# EAGLE design RS485Interface (EAGLE 7.2.0)
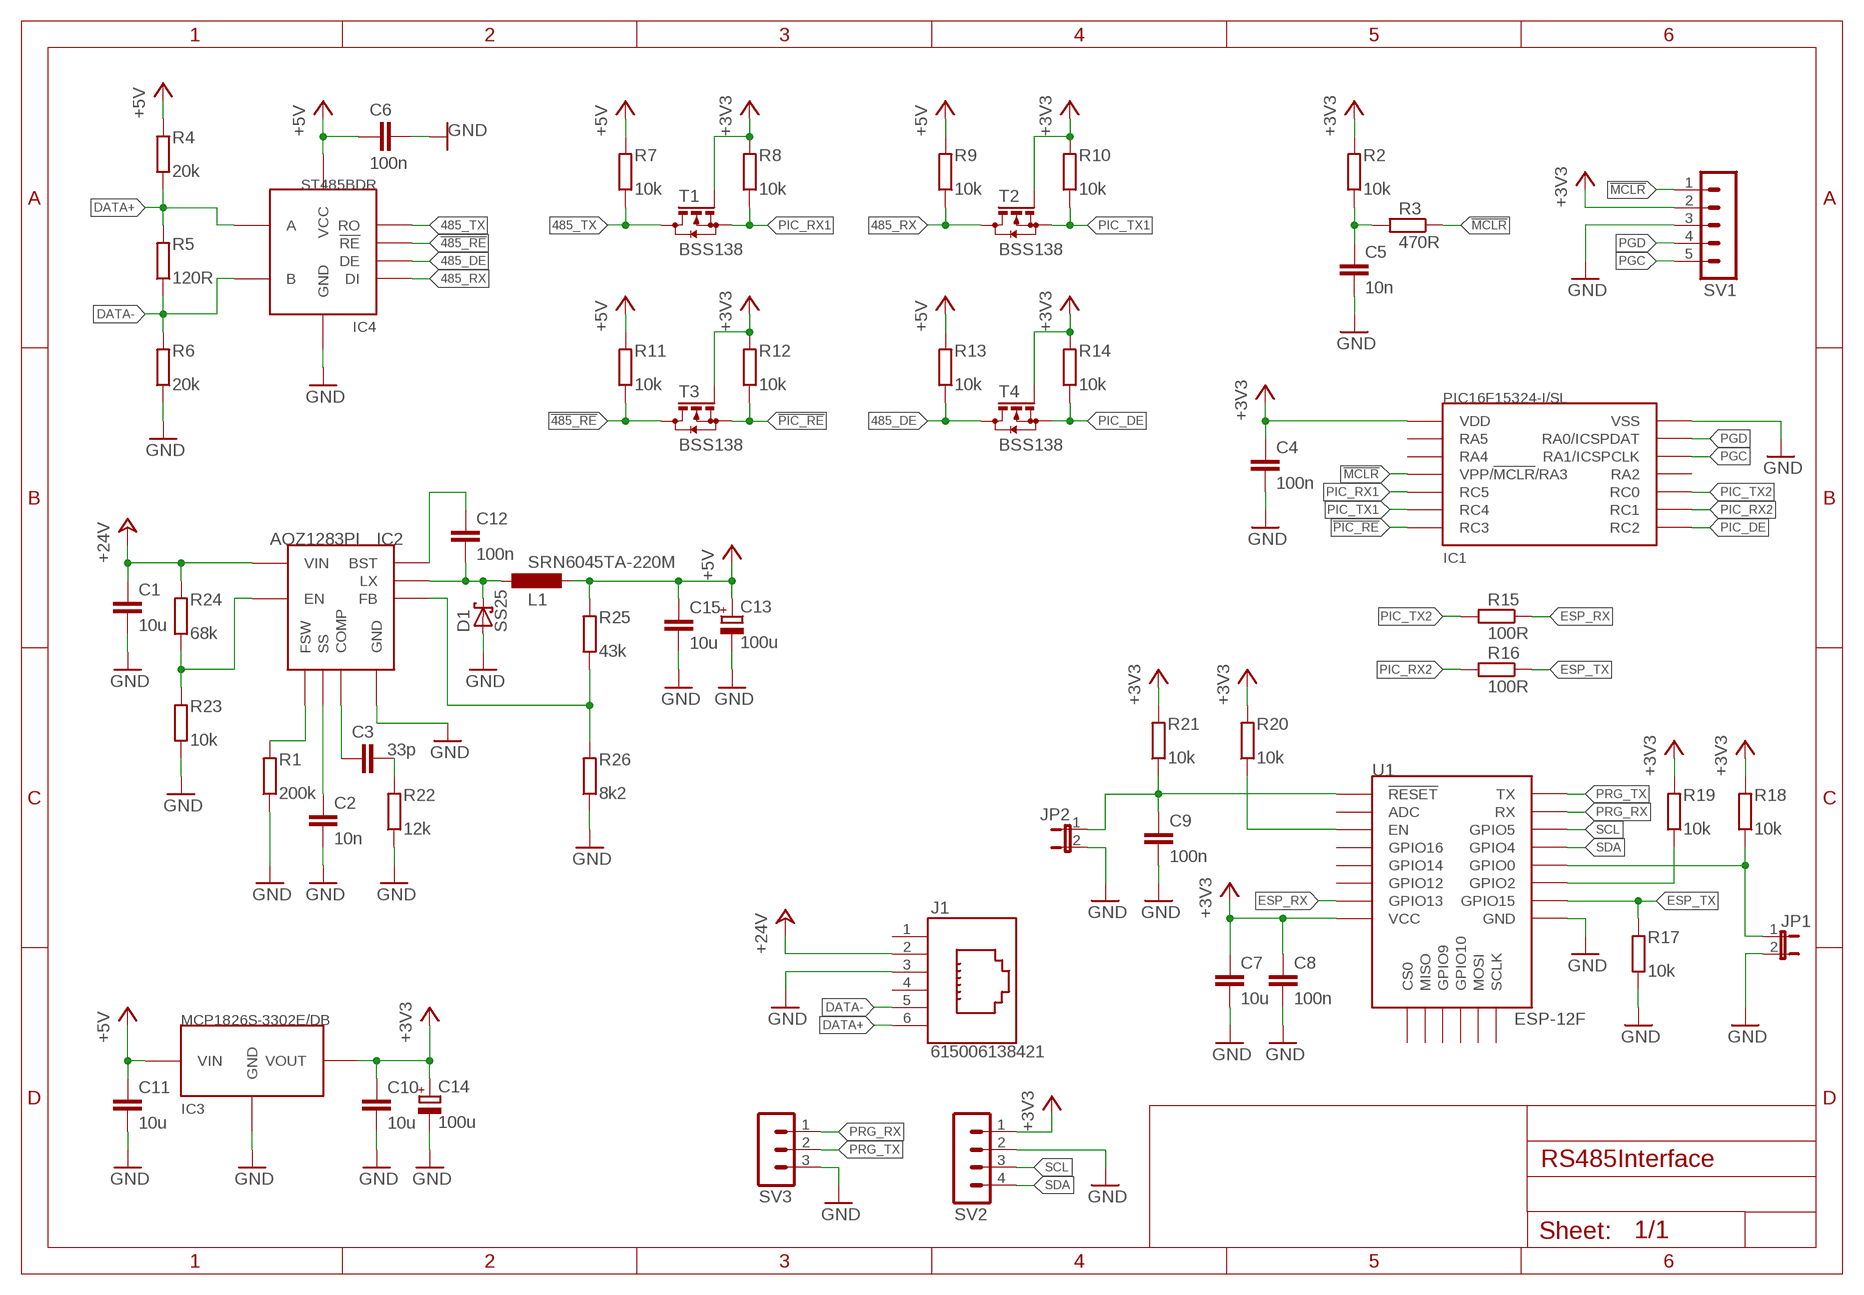
[diagram p0: schematic, sheet 1]

## Parts
C1  10u  C-EUC0805  [C0805]
C2  10n  C-EUC0805  [C0805]
C3  33p  C-EUC0805  [C0805]
C4  100n  C-EUC0805  [C0805]
C5  10n  C-EUC0805  [C0805]
C6  100n  C-EUC0805  [C0805]
C7  10u  C-EUC0805  [C0805]
C8  100n  C-EUC0805  [C0805]
C9  100n  C-EUC0805  [C0805]
C10  10u  C-EUC0805  [C0805]
C11  10u  C-EUC0805  [C0805]
C12  100n  C-EUC0805  [C0805]
C13  100u  UCL  [UCL6.3]
C14  100u  UCL  [UCL6.3]
C15  10u  C-EUC0805  [C0805]
D1  SS25  [DO-214AA]
IC1  PIC16F15324-I/SL  [SOIC14]
IC2  AOZ1283PI  [SO8+PAD]
IC3  MCP1826S-3302E/DB  [SOT-223-3]
IC4  ST485BDR  [SOIC8]
J1  615006138421  [615006138421]
JP1  JP1E  [JP1]
JP2  JP1E  [JP1]
L1  SRN6045TA-220M  [SRN6045TA]
R1  200k  R-EU_R0805  [R0805]
R2  10k  R-EU_R0805  [R0805]
R3  470R  R-EU_R0805  [R0805]
R4  20k  R-EU_R0805  [R0805]
R5  120R  R-EU_R0805  [R0805]
R6  20k  R-EU_R0805  [R0805]
R7  10k  R-EU_R0805  [R0805]
R8  10k  R-EU_R0805  [R0805]
R9  10k  R-EU_R0805  [R0805]
R10  10k  R-EU_R0805  [R0805]
R11  10k  R-EU_R0805  [R0805]
R12  10k  R-EU_R0805  [R0805]
R13  10k  R-EU_R0805  [R0805]
R14  10k  R-EU_R0805  [R0805]
R15  100R  R-EU_R0805  [R0805]
R16  100R  R-EU_R0805  [R0805]
R17  10k  R-EU_R0805  [R0805]
R18  10k  R-EU_R0805  [R0805]
R19  10k  R-EU_R0805  [R0805]
R20  10k  R-EU_R0805  [R0805]
R21  10k  R-EU_R0805  [R0805]
R22  12k  R-EU_R0805  [R0805]
R23  10k  R-EU_R0805  [R0805]
R24  68k  R-EU_R0805  [R0805]
R25  43k  R-EU_R0805  [R0805]
R26  8k2  R-EU_R0805  [R0805]
SV1  MA05-1  [MA05-1]
SV2  MA04-1  [MA04-1]
SV3  MA03-1  [MA03-1]
T1  BSS138  [SOT-23]
T2  BSS138  [SOT-23]
T3  BSS138  [SOT-23]
T4  BSS138  [SOT-23]
U1  ESP-12F  ESP12ESMD  [ESP12E-SMD]

## Nets
485_DE: IC4.P3(DE) R13.1 T4.P3(D)
485_RX: IC4.P4(DI) R9.1 T2.P3(D)
485_TX: IC4.P1(RO) R7.1 T1.P3(D)
!485_RE: IC4.P2(!RE) R11.1 T3.P3(D)
!MCLR: IC1.P4(VPP/!MCLR!/RA3) R3.1 SV1.1
!PIC_RE: IC1.P7(RC3) R12.1 T3.P2(S)
!RESET: C9.1 JP2.1 R21.1 U1.RESET(!RESET)
+3V3: C4.1 C7.1 C8.1 C10.1 C14.+ IC1.P1(VDD) IC3.P3(VOUT) R2.2 R8.2 R10.2 R12.2 R14.2 R18.2 R19.2 R20.2 R21.2 SV1.2 SV2.1 T1.P1(G) T2.P1(G) T3.P1(G) T4.P1(G) U1.VCC
+5V: C6.1 C11.1 C13.+ C15.1 IC3.P1(VIN) IC4.P8(VCC) L1.P$1 R4.2 R7.2 R9.2 R11.2 R13.2 R25.2
+24V: C1.1 IC2.PAD(VIN) J1.2 R24.2
DATA+: IC4.P6(A) J1.6 R4.1 R5.2
DATA-: IC4.P7(B) J1.5 R5.1 R6.2
EN: R20.1 U1.EN
ESP_RX: R15.1 U1.GPIO13
ESP_TX: R16.1 R17.2 U1.GPIO15
GND: C1.2 C2.2 C4.2 C5.2 C6.2 C7.2 C8.2 C9.2 C10.2 C11.2 C13.- C14.- C15.2 D1.A IC1.P14(VSS) IC2.P3(GND) IC3.P2(GND) IC3.P4(GND) IC4.P5(GND) J1.3 JP1.2 JP2.2 R1.1 R6.1 R17.1 R22.1 R23.1 R26.1 SV1.3 SV2.2 SV3.3 U1.GND
GPIO0: JP1.1 R18.1 U1.GPIO0
GPIO2: R19.1 U1.GPIO2
LX: C12.2 D1.C IC2.P1(LX) L1.P$2
N$1: IC2.P8(EN) R23.2 R24.1
N$2: C3.1 IC2.P5(COMP)
N$3: C5.1 R2.1 R3.2
N$4: C3.2 R22.2
N$5: C2.1 IC2.P7(SS)
N$6: IC2.P4(FSW) R1.2
N$7: IC2.P6(FB) R25.1 R26.2
N$9: C12.1 IC2.P2(BST)
PGC: IC1.P12(RA1/ICSPCLK) SV1.5
PGD: IC1.P13(RA0/ICSPDAT) SV1.4
PIC_DE: IC1.P8(RC2) R14.1 T4.P2(S)
PIC_RX1: IC1.P5(RC5) R8.1 T1.P2(S)
PIC_RX2: IC1.P9(RC1) R16.2
PIC_TX1: IC1.P6(RC4) R10.1 T2.P2(S)
PIC_TX2: IC1.P10(RC0) R15.2
PRG_RX: SV3.1 U1.RXD0(RX)
PRG_TX: SV3.2 U1.TXD0(TX)
SCL: SV2.3 U1.GPIO5
SDA: SV2.4 U1.GPIO4
Unconnected: IC1.P2(RA5) IC1.P3(RA4) IC1.P11(RA2) J1.1 J1.4 U1.ADC U1.CS0 U1.GPIO9 U1.GPIO10 U1.GPIO12 U1.GPIO14 U1.GPIO16 U1.MISO U1.MOSI U1.SCLK

## Library data of the parts
C1-C12 C15 = rcl:C-EU: CAPACITOR, European symbol
C13 C14 = RS485Interface:UCL*: UCL - ALUMINUM ELECTROLYTIC CAPACITORS Chip Type, Low Impedance; NR: UCL1C101MCL6GS
D1 = RS485Interface:SS2*: SS22 - S210 - Schottky Rectifier
IC1 = RS485Interface:PIC16F15324: PIC16F15324
IC2 = RS485Interface:AOZ1283PI: AOZ1283 EZBuck™ 2.5A Simple Buck Regulator
IC3 = RS485Interface:MCP1826S: MCP1826
IC4 = RS485Interface:ST485B: ST485B
J1 = InputOutputIO (rev19b):615006138421: WR-MJ Horizontal Plastic 6P6C Modular Jack Tab Up, 6 Pins=>Code : Con_I-O_MJ-H_Plastic_Up_615006138421 <http://katalog.we-online.de/media/images/eican/Con_I-O_MJ-H_Plastic_Up_6150xx138421_pf2.jpg> Details see: http://katalog.we-online.de/en/em/MJ_HORIZONTAL_PLASTIC_6PXC_TAB_UP Created 2014-07-10, Karrer Zheng 2014 (C) Würth Elektronik
JP1 JP2 = jumper:JP1E: JUMPER
L1 = RS485Interface:SRN6045TA-: SRN6045TA Series - Semi-shielded Power Inductors
R1-R26 = rcl:R-EU_: RESISTOR, European symbol
SV1 = con-lstb:MA05-1: PIN HEADER; OC_FARNELL: unknown; OC_NEWARK: unknown
SV2 = con-lstb:MA04-1: PIN HEADER; OC_FARNELL: unknown; OC_NEWARK: unknown
SV3 = con-lstb:MA03-1: PIN HEADER; OC_FARNELL: unknown; OC_NEWARK: unknown
T1-T4 = RS485Interface:BSS138: BSS138 - Power MOSFET, 200 mA, 50V, N-Channel, SOT-23
U1 = esp8266modules:ESP12E: ESP12E Module

## Board
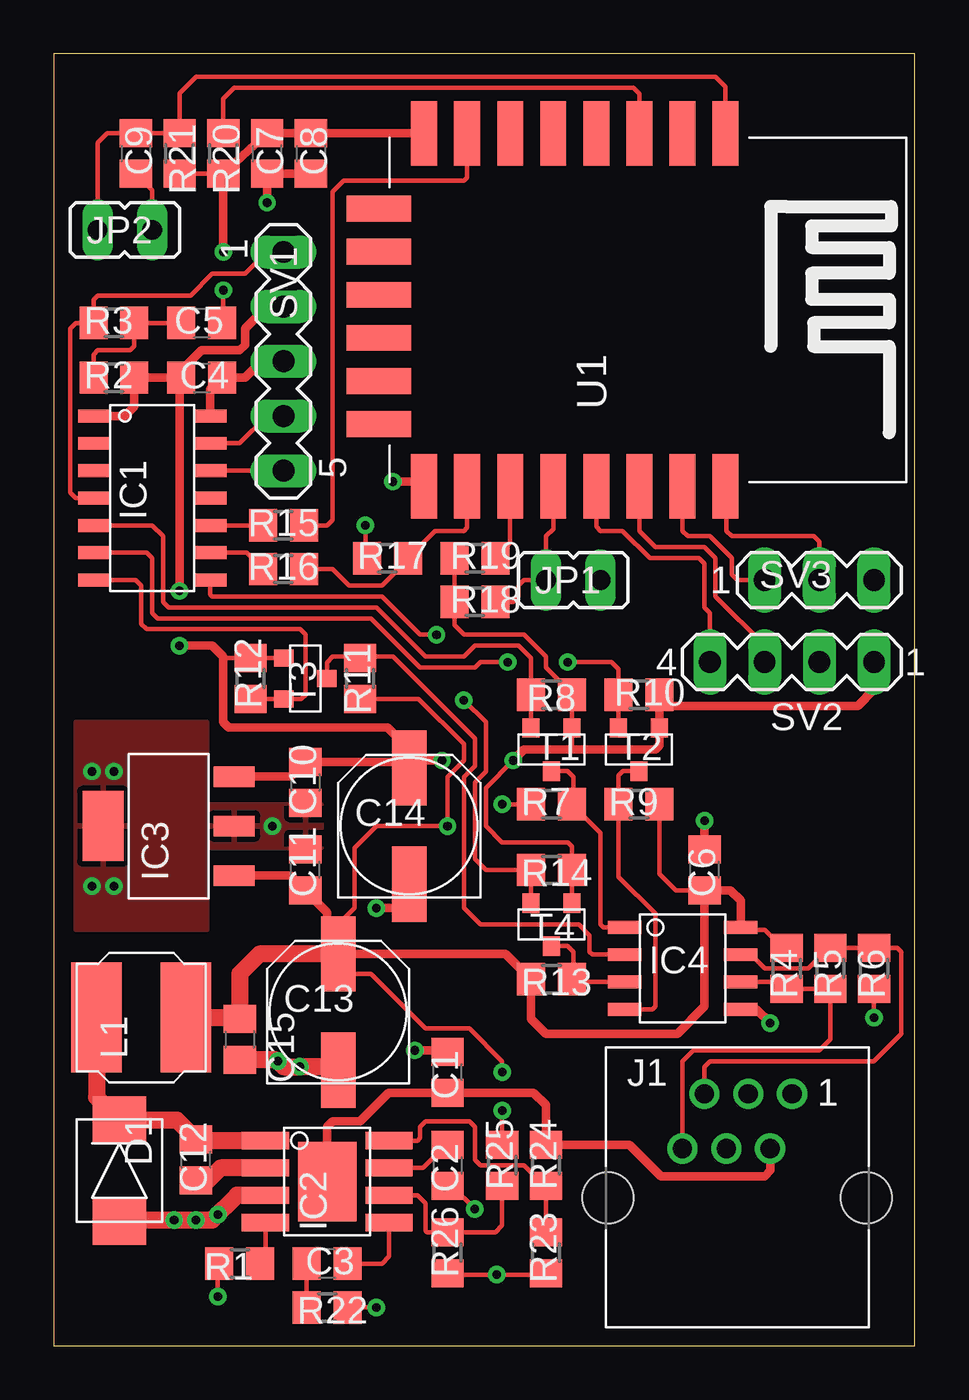
[diagram p1: board, top side]
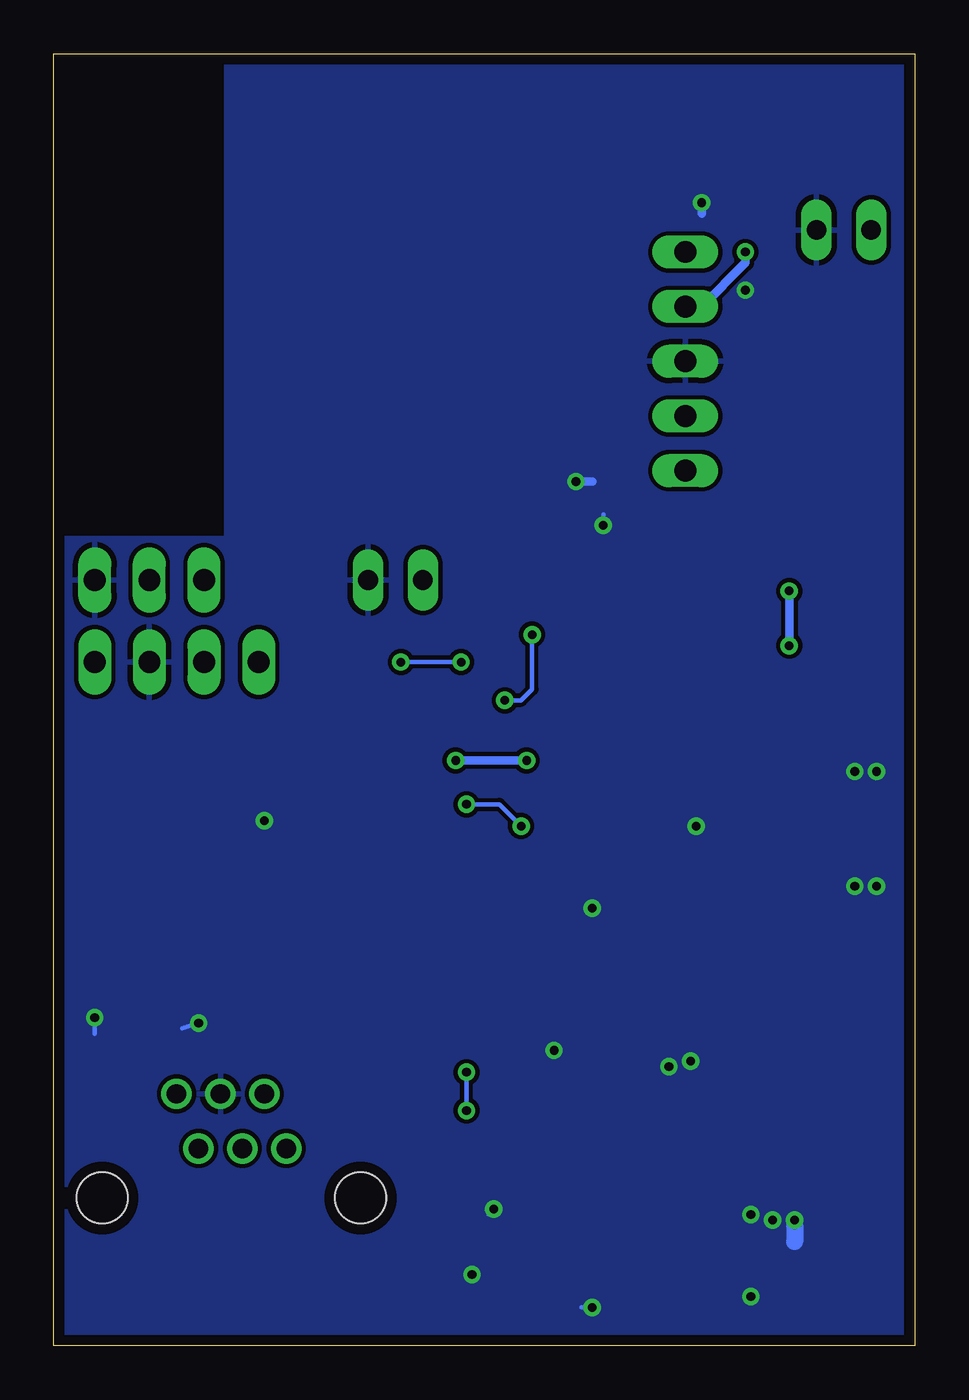
[diagram p2: board, bottom side, seen from below]

Size 40 x 60 mm. Coordinates in mm from the lower left corner, seen from the top.
Outline: 0,0 40,0 40,60 0,60 0,0
Copper layers (1*16): Top 0.035mm / dielectric 1.5mm / Bottom 0.035mm
Design rules "default *": minimum track width 0.2mm, minimum drill 0.4mm, track to track 0.2mm, track to pad 0.2mm, pad to pad 0.2mm, via to via 0.2mm, smd to smd 0.2mm, copper to edge 0.5mm, drill to drill 8mil, minimum pad ring 10mil, minimum via ring 8mil, stop-mask expansion 4mil, vias tented up to drill 0mil, thermal gap 10mil

### Footprints (pad centres in the part's own frame; a part is rotated, then mirrored left to right if it is on the bottom)
C0805 = smd 1.3 x 1.5: 1 -0.95,0; 2 0.95,0
UCL6.3 = smd 1.6 x 3.5: + 0,2.7; - 0,-2.7
DO-214AA = smd 2.2 x 2.5: A 2.35,0; C -2.35,0
SOIC14 = smd 1.5 x 0.6: P1 -2.7,3.81; P2 -2.7,2.54; P3 -2.7,1.27; P4 -2.7,0; P5 -2.7,-1.27; P6 -2.7,-2.54; P7 -2.7,-3.81; P8 2.7,-3.81; P9 2.7,-2.54; P10 2.7,-1.27; P11 2.7,0; P12 2.7,1.27; P13 2.7,2.54; P14 2.7,3.81
SO8+PAD = smd 0.8 x 2.2: P1 -1.905,-2.87; P2 -0.635,-2.87; P3 0.635,-2.87; P4 1.905,-2.87; P5 1.905,2.87; P6 0.635,2.87; P7 -0.635,2.87; P8 -1.905,2.87 | smd 3.7 x 2.71: PAD 0,0
SOT-223-3 = smd 0.95 x 1.9: P1 -2.3,-3.05; P2 0,-3.05; P3 2.3,-3.05 | smd 3.25 x 1.9: P4 0,3.05
SOIC8 = smd 1.55 x 0.6: P1 -2.7,1.905; P2 -2.7,0.635; P3 -2.7,-0.635; P4 -2.7,-1.905; P5 2.7,-1.905; P6 2.7,-0.635; P7 2.7,0.635; P8 2.7,1.905
615006138421 = drill 0.9: 1 2.55,4.84; 2 1.53,2.3; 3 0.51,4.84; 4 -0.51,2.3; 5 -1.53,4.84; 6 -2.55,2.3 | hole 2.36: -6,0; 6,0
JP1 = drill 0.914 long: 1 0,-1.27; 2 0,1.27
SRN6045TA = smd 5.1 x 2.35: P$1 0,-2.075; P$2 0,2.075
R0805 = smd 1.3 x 1.5: 1 -0.95,0; 2 0.95,0
MA05-1 = drill 1.016 long: 1 -5.08,0; 2 -2.54,0; 3 0,0; 4 2.54,0; 5 5.08,0
MA04-1 = drill 1.016 long: 1 -3.81,0; 2 -1.27,0; 3 1.27,0; 4 3.81,0
MA03-1 = drill 1.016 long: 1 -2.54,0; 2 0,0; 3 2.54,0
SOT-23 = smd 0.8 x 0.9: P1 -0.95,-1; P2 0.95,-1; P3 0,1
ESP12E-SMD = smd 3 x 1.2: ADC -8.3,3.8; EN -8.3,1.8; GND 8.1,-8.2; GPIO0 8.1,-2.2; GPIO2 8.1,-4.2; GPIO4 8.1,-0.2; GPIO5 8.1,1.8; GPIO12 -8.3,-4.2; GPIO13 -8.3,-6.2; GPIO14 -8.3,-2.2; GPIO15 8.1,-6.2; GPIO16 -8.3,-0.2; RESET -8.3,5.8; RXD0 8.1,3.8; TXD0 8.1,5.8; VCC -8.3,-8.2 | smd 1.2 x 3: CS0 -4.8,-10.3; GPIO9 -0.8,-10.3; GPIO10 1.2,-10.3; MISO -2.8,-10.3; MOSI 3.2,-10.3; SCLK 5.2,-10.3

### Placement (x,y rotation side)
C1  18.29,12.7 90 top
C2  18.29,8.38 270 top
C3  12.7,3.81 180 top
C4  6.86,44.96 0 top
C5  6.86,47.5 0 top
C6  30.23,22.1 90 top
C7  9.91,55.37 270 top
C8  11.94,55.37 270 top
C9  3.81,55.37 270 top
C10  11.68,26.16 270 top
C11  11.68,22.1 90 top
C12  6.6,8.64 90 top
C13  13.21,15.49 0 top
C14  16.51,24.13 0 top
C15  8.64,14.22 270 top
D1  3.05,8.13 270 top
IC1  4.57,39.37 0 top
IC2  12.7,7.62 270 top
IC3  5.33,24.13 90 top
IC4  29.21,17.53 0 top
J1  31.75,6.86 0 top
JP1  24.13,35.56 270 top
JP2  3.3,51.82 270 top
L1  4.06,15.24 90 top
R1  8.64,3.81 0 top
R2  2.79,44.96 0 top
R3  2.79,47.5 0 top
R4  34.04,17.53 90 top
R5  36.07,17.53 270 top
R6  38.1,17.53 90 top
R7  23.11,25.15 180 top
R8  23.11,30.23 0 top
R9  27.18,25.15 0 top
R10  27.18,30.23 0 top
R11  14.22,30.99 270 top
R12  9.14,30.99 90 top
R13  23.11,17.02 180 top
R14  23.11,22.1 0 top
R15  10.67,38.1 180 top
R16  10.67,36.07 180 top
R17  15.49,36.58 0 top
R18  19.56,34.54 180 top
R19  19.56,36.58 180 top
R20  7.87,55.37 270 top
R21  5.84,55.37 270 top
R22  12.7,1.78 180 top
R23  22.86,4.32 90 top
R24  22.86,8.38 90 top
R25  20.83,8.38 90 top
R26  18.29,4.32 90 top
SV1  10.67,45.72 270 top
SV2  34.29,31.75 180 top
SV3  35.56,35.56 0 top
T1  23.11,27.69 180 top
T2  27.18,27.69 180 top
T3  11.68,30.99 270 top
T4  23.11,19.56 180 top
U1  25.4,48.01 270 top

### Tracks (layer width: path | path; a pad name or v marks a point on that pad's centre or on a via)
485_DE
  Top 0.2: T4.P3 23.86,18.56 24.13,18.29 24.13,16.83 R13.1 24.19,16.89 IC4.P3
485_RX
  Top 0.2: IC4.P4 27.81,15.62 27.94,15.75 27.94,20.07 26.23,21.78 R9.1 26.23,26.48 26.43,26.69 T2.P3
485_TX
  Top 0.2: T1.P3 23.86,26.69 24.13,26.42 24.13,24.96 R7.1 25.4,23.81 25.4,19.56 25.53,19.43 IC4.P1
!485_RE
  Top 0.2: T3.P3 12.68,31.73 12.95,32 14.41,32 | 14.41,32 R11.1 | 14.41,32 15.75,32 19.56,28.19 19.56,26.92 19.05,26.42 19.05,20.32 19.81,19.56 24.38,19.56 24.89,19.05 24.89,18.29 25.02,18.16 IC4.P2
!MCLR
  Top 0.2: IC1.P4 1.02,39.37 0.76,39.62 0.76,47.24 1.02,47.5 R3.1 1.84,48.58 2.03,48.77 6.35,48.77 7.37,49.78 8.89,49.78 9.65,50.55 10.41,50.55 SV1.1
!PIC_RE
  Top 0.2: R12.1 T3.P2 11.5,30.04 11.68,30.23 11.68,33.02 11.43,33.27 4.32,33.27 4.06,33.53 4.06,35.31 3.81,35.56 IC1.P7
!RESET
  Top 0.2: U1.RESET 31.2,58.46 30.73,58.93 6.6,58.93 5.84,58.17 R21.1 C9.1 2.47,56.32 2.03,55.88 JP2.1
+3V3  (via drill 0.4)
  Top 0.2: T3.P1 R12.2 7.94,31.94 7.87,32 | T4.P1 R14.2 24.06,23.18 23.88,23.37 20.83,23.37 20.07,24.13 20.07,25.91 v21.34,27.18 | R19.2 R18.2 18.61,33.46 19.05,33.02 21.84,33.02 22.86,32 22.86,31.5 24.06,30.29 R8.2 T1.P1 24.06,27.87 23.88,27.69 | 16.86,27.18 C14.+ | R21.2 R20.2
  Top 0.4: U1.VCC 11.95,56.31 C8.1 C7.1 R20.2 v7.87,50.8 | IC1.P1 3.3,43.18 3.74,43.62 R2.2 C4.1 | SV1.2 9.91,48.26 8.89,47.24 8.89,46.48 8.64,46.23 6.86,46.23 5.91,45.28 C4.1 | IC3.P3 11,26.43 C10.1 16.23,27.11 | 16.23,27.11 C14.+ | C4.1 5.84,44.89 v5.84,35.05 | 16.23,27.11 16.23,27.97 15.49,28.7 8.13,28.7 7.87,28.96 7.87,32 7.37,32.51 v5.84,32.51 | v18.03,27.18 16.86,27.18 | R10.2 28.64,29.72 | 28.64,29.72 37.34,29.72 38.1,30.48 SV2.1 | 28.64,29.72 28.13,29.72 T2.P1 28.13,27.87 27.94,27.69 23.88,27.69 21.84,27.69 v21.34,27.18
  Bottom 0.4: v5.84,35.05 v5.84,32.51 | v18.03,27.18 v21.34,27.18 | v7.87,50.8 7.87,50.29 9.91,48.26 SV1.2
+5V  (via drill 0.4)
  Top 0.2: R4.2 33.85,18.48 33.02,19.3 32.04,19.3 IC4.P8 | R25.2 v20.83,10.92 | v20.83,12.7 20.83,13.21 19.3,14.73 17.27,14.73 14.73,17.27 12.7,17.27 C13.+ | R11.2 16.95,30.04 19.05,27.94 19.05,27.18 18.29,26.42 v18.29,24.13 14.99,24.13 13.97,23.11 13.97,20.32 12.7,19.05 | R7.2 v20.83,25.15 | C6.1 28.89,21.15 28.13,21.91 R9.2
  Top 0.4: IC3.P1 11,21.83 C11.1 12.7,20.13 12.7,19.05 C13.+ | C13.+ 12.86,18.03 | C13.+ 20.99,18.19 R13.2 22.16,15.17 22.86,14.48 28.96,14.48 30.23,15.75 C6.1 31.43,21.15 31.91,20.67 IC4.P8
  Top 0.8: L1.P$1 8.32,15.24 C15.1 8.64,17.27 9.56,18.19 C13.+
  Bottom 0.2: v20.83,10.92 v20.83,12.7 | v20.83,25.15 19.3,25.15 v18.29,24.13
+24V
  Top 0.4: J1.2 33.28,8.13 33.02,7.87 28.19,7.87 26.74,9.33 R24.2 22.86,11.18 22.29,11.75 C1.1 15.56,11.75 14.22,10.41 12.95,10.41 12.7,10.16 IC2.PAD
DATA+
  Top 0.2: IC4.P6 33.72,16.89 R4.1 R5.2 36.07,14.22 35.56,13.72 29.72,13.72 29.2,13.2 J1.6
DATA-
  Top 0.2: IC4.P7 32.38,18.16 33.02,17.53 35.05,17.53 35.56,18.03 35.63,18.03 R5.1 R6.2 39.18,18.48 39.37,18.29 39.37,14.48 38.1,13.21 30.48,13.21 30.22,12.95 J1.5
EN
  Top 0.2: U1.EN 27.2,58.14 26.92,58.42 8.38,58.42 7.87,57.91 R20.1
ESP_RX
  Top 0.2: U1.GPIO13 19.2,54.25 19.05,54.1 13.46,54.1 12.95,53.59 12.95,38.35 12.7,38.1 R15.1
ESP_TX
  Top 0.2: R16.1 12.95,36.07 13.72,35.31 15.24,35.31 16.44,36.51 R17.2 17.71,37.85 19.05,37.85 19.2,38 U1.GPIO15
GND  (via drill 0.4)
  Top 0.2: R6.1 v38.1,15.24 | IC4.P5 32,15.62 | JP2.2 4.57,53.66 C9.2 | C5.2 7.87,47.56 v7.87,49.02 | R17.1 14.48,36.64 v14.48,38.1 | R1.1 7.62,3.74 v7.62,2.29 | R22.1 v14.99,1.78 | C2.2 18.48,7.43 v19.56,6.35 | R26.1 18.35,3.3 v20.57,3.3 22.79,3.3 R23.1
  Top 0.4: 32,15.62 32.64,15.62 v33.27,14.99 | v9.91,53.09 C7.2 C8.2 | SV1.3 9.65,45.72 8.89,44.96 C4.2 7.27,44.42 IC1.P14 | U1.GND 16.97,40.13 v15.75,40.13 | C1.2 18.35,13.72 v16.76,13.72 | v14.99,20.32 16.51,20.32 C14.- | C6.2 v30.23,24.38
  Top 0.8: IC2.P3 8.51,6.99 7.37,5.84 v6.6,5.84 3.11,5.84 D1.A | C13.- 12.54,12.95 v11.43,12.95 10.67,12.95 v10.41,13.21 10.35,13.27 C15.2
  Bottom 0.2: v38.1,15.24 38.1,14.48 | v33.27,14.99 34.04,14.73 | v14.48,38.1 14.48,38.61 | v7.62,2.29 7.37,2.29 | v14.99,1.78 15.49,1.78 | v19.56,6.35 19.81,6.1 | v20.57,3.3 20.57,3.56
  Bottom 0.4: v9.91,53.09 9.91,52.58 | v15.75,40.13 14.99,40.13
  Bottom 0.8: 5.59,5.59 5.59,4.83
  other vias: 1.78,26.67 2.79,26.67 2.79,21.34 1.78,21.34 10.16,24.13 5.59,5.84 7.62,6.1
  pour Bottom: 40,0 40,37.5 32,37.5 32,60 0,60 0,0
  pour Top: 12.45,23.11 12.45,25.15 7.11,25.15 7.11,28.96 1.02,28.96 1.02,19.3 7.11,19.3 7.11,23.11
GPIO0
  Top 0.2: U1.GPIO0 23.2,37.93 22.86,37.59 JP1.1 21.84,35.56 21.59,35.31 21.59,34.8 21.34,34.54 R18.1
GPIO2
  Top 0.2: U1.GPIO2 21.2,37.27 R19.1
LX
  Top 0.8: IC2.P1 7.17,9.53 C12.2 5.71,10.48 D1.C 1.99,11.54 L1.P$2
N$1
  Top 0.2: R23.2 R24.1 22.54,7.37 22.54,7.69 21.84,8.38 19.81,8.38 19.56,8.64 19.56,10.16 19.3,10.41 17.27,10.41 17.02,10.16 17.02,9.65 16.89,9.53 IC2.P8
N$2
  Top 0.2: 15.68,5.6 IC2.P5 15.57,4.14 15.24,3.81 C3.1
N$3
  Top 0.2: C5.1 R3.2 3.74,46.42 3.56,46.23 2.03,46.23 1.84,46.04 R2.1
N$4
  Top 0.2: R22.2 C3.2
N$5
  Top 0.2: C2.1 18.22,9.33 17.14,8.26 IC2.P7
N$6
  Top 0.2: IC2.P4 9.83,4.05 R1.2
N$7
  Top 0.2: IC2.P6 16.89,6.99 17.27,6.6 17.27,5.33 17.34,5.27 R26.2 20.51,5.27 20.83,5.59 R25.1
N$9
  Top 0.8: C12.1 7.18,7.69 7.75,8.26 IC2.P2
PGC
  Top 0.2: IC1.P12 SV1.5
PGD
  Top 0.2: SV1.4 9.91,43.18 8.64,41.91 IC1.P13
PIC_DE  (via drill 0.4)
  Top 0.2: T4.P2 R14.1 20.07,22.1 19.56,22.61 19.56,26.16 20.07,26.67 20.07,28.96 v19.05,29.97 | IC1.P8 7.27,34.89 7.37,34.8 15.24,34.8 17.02,33.02 v17.78,33.02
  Bottom 0.2: v19.05,29.97 18.29,29.97 17.78,30.48 v17.78,33.02
PIC_RX1
  Top 0.2: T1.P2 R8.1 22.16,31.94 21.59,32.51 19.56,32.51 19.05,32 17.27,32 14.99,34.29 5.33,34.29 5.08,34.54 5.08,37.59 4.57,38.1 IC1.P5
PIC_RX2
  Top 0.2: IC1.P9 8.96,36.83 R16.2
PIC_TX1  (via drill 0.4)
  Top 0.2: T2.P2 R10.1 26.23,31.43 25.91,31.75 v23.88,31.75 | IC1.P6 4.32,36.83 4.57,36.58 4.57,34.04 4.83,33.78 14.73,33.78 17.02,31.5 19.56,31.5 19.81,31.75 v21.08,31.75
  Bottom 0.2: v21.08,31.75 v23.88,31.75
PIC_TX2
  Top 0.2: IC1.P10 R15.2
PRG_RX
  Top 0.2: SV3.1 31.75,35.56 31.5,35.81 31.5,36.58 30.48,37.59 29.46,37.59 29.21,37.85 29.21,39.9 U1.RXD0
PRG_TX
  Top 0.2: SV3.2 35.56,37.34 35.31,37.59 31.5,37.59 31.24,37.85 31.24,39.86 U1.TXD0
SCL
  Top 0.2: U1.GPIO5 27.2,37.82 27.94,37.08 30.23,37.08 30.73,36.58 30.73,34.8 33.02,32.51 SV2.3
SDA
  Top 0.2: U1.GPIO4 25.2,38.05 25.4,37.85 26.42,37.85 27.69,36.58 29.97,36.58 30.23,36.32 30.23,34.29 30.48,34.04 SV2.4

### Text on the board
Silkscreen: 1 | RESET | . | 1 | BOOT | 1 | + | RS485 V1 | + | . | 1 | C | .